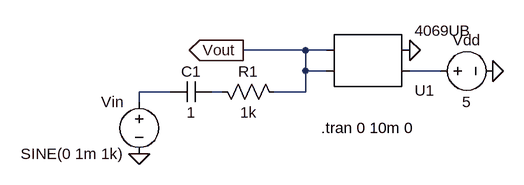
[diagram p0: schematic Q2b.asc]
Q2b.asc, the LTspice schematic file:
Version 4
SHEET 1 880 680
WIRE 128 112 32 112
WIRE 160 112 128 112
WIRE 128 144 128 112
WIRE 160 144 128 144
WIRE 336 144 288 144
WIRE -80 176 -128 176
WIRE 0 176 -16 176
WIRE 128 176 128 144
WIRE 128 176 80 176
WIRE -128 192 -128 176
FLAG -128 272 0
FLAG 32 112 Vout
IOPIN 32 112 Out
FLAG 288 112 0
FLAG 416 144 0
SYMBOL voltage -128 176 M0
WINDOW 123 0 0 Left 0
WINDOW 39 0 0 Left 0
SYMATTR InstName Vin
SYMATTR Value SINE(0 1m 1k)
SYMBOL res -16 160 M90
WINDOW 0 0 56 VBottom 2
WINDOW 3 32 56 VTop 2
SYMATTR InstName R1
SYMATTR Value 1k
SYMBOL cap -16 160 R90
WINDOW 0 0 32 VBottom 2
WINDOW 3 32 32 VTop 2
SYMATTR InstName C1
SYMATTR Value 1
SYMBOL AutoGenerated\\4069UB 224 128 M180
SYMATTR InstName U1
SYMBOL voltage 320 144 R270
WINDOW 0 32 56 VTop 2
WINDOW 3 -32 56 VBottom 2
WINDOW 123 0 0 Left 0
WINDOW 39 0 0 Left 0
SYMATTR InstName Vdd
SYMATTR Value 5
TEXT 152 232 Left 2 !.tran 0 10m 0

The netlist it stands for:
* Q2b.asc
Vin N002 0 SINE(0 1m 1k)
R1 N003 Vout 1k
C1 N003 N002 1
* U1: 4069UB (symbol AutoGenerated\4069UB not available, pins judged from their places): pin1=Vout pin2=Vout pin3=N001 pin4=0
Vdd N001 0 5
.tran 0 10m 0
.backanno
.end